# Altium schematic sheet Mainboard-mbed.SchDoc
size A3; PageSetup: Record=PageOptions|CenterHorizontal=True|CenterVertical=True|PrintScale=1.00|XCorrection=1.00|YCorrection=1.00|PrintKind=1|BorderSize=5000000|LeftOffset=0|BottomOffset=0|Orientation=2|PaperLength=1000|PaperWidth=1000|Scale=100|PaperSource=7|PrintQuality=-3|MediaType=1|DitherType=10|PrintScaleMode=1|PaperKind=A3|PaperIndex=8
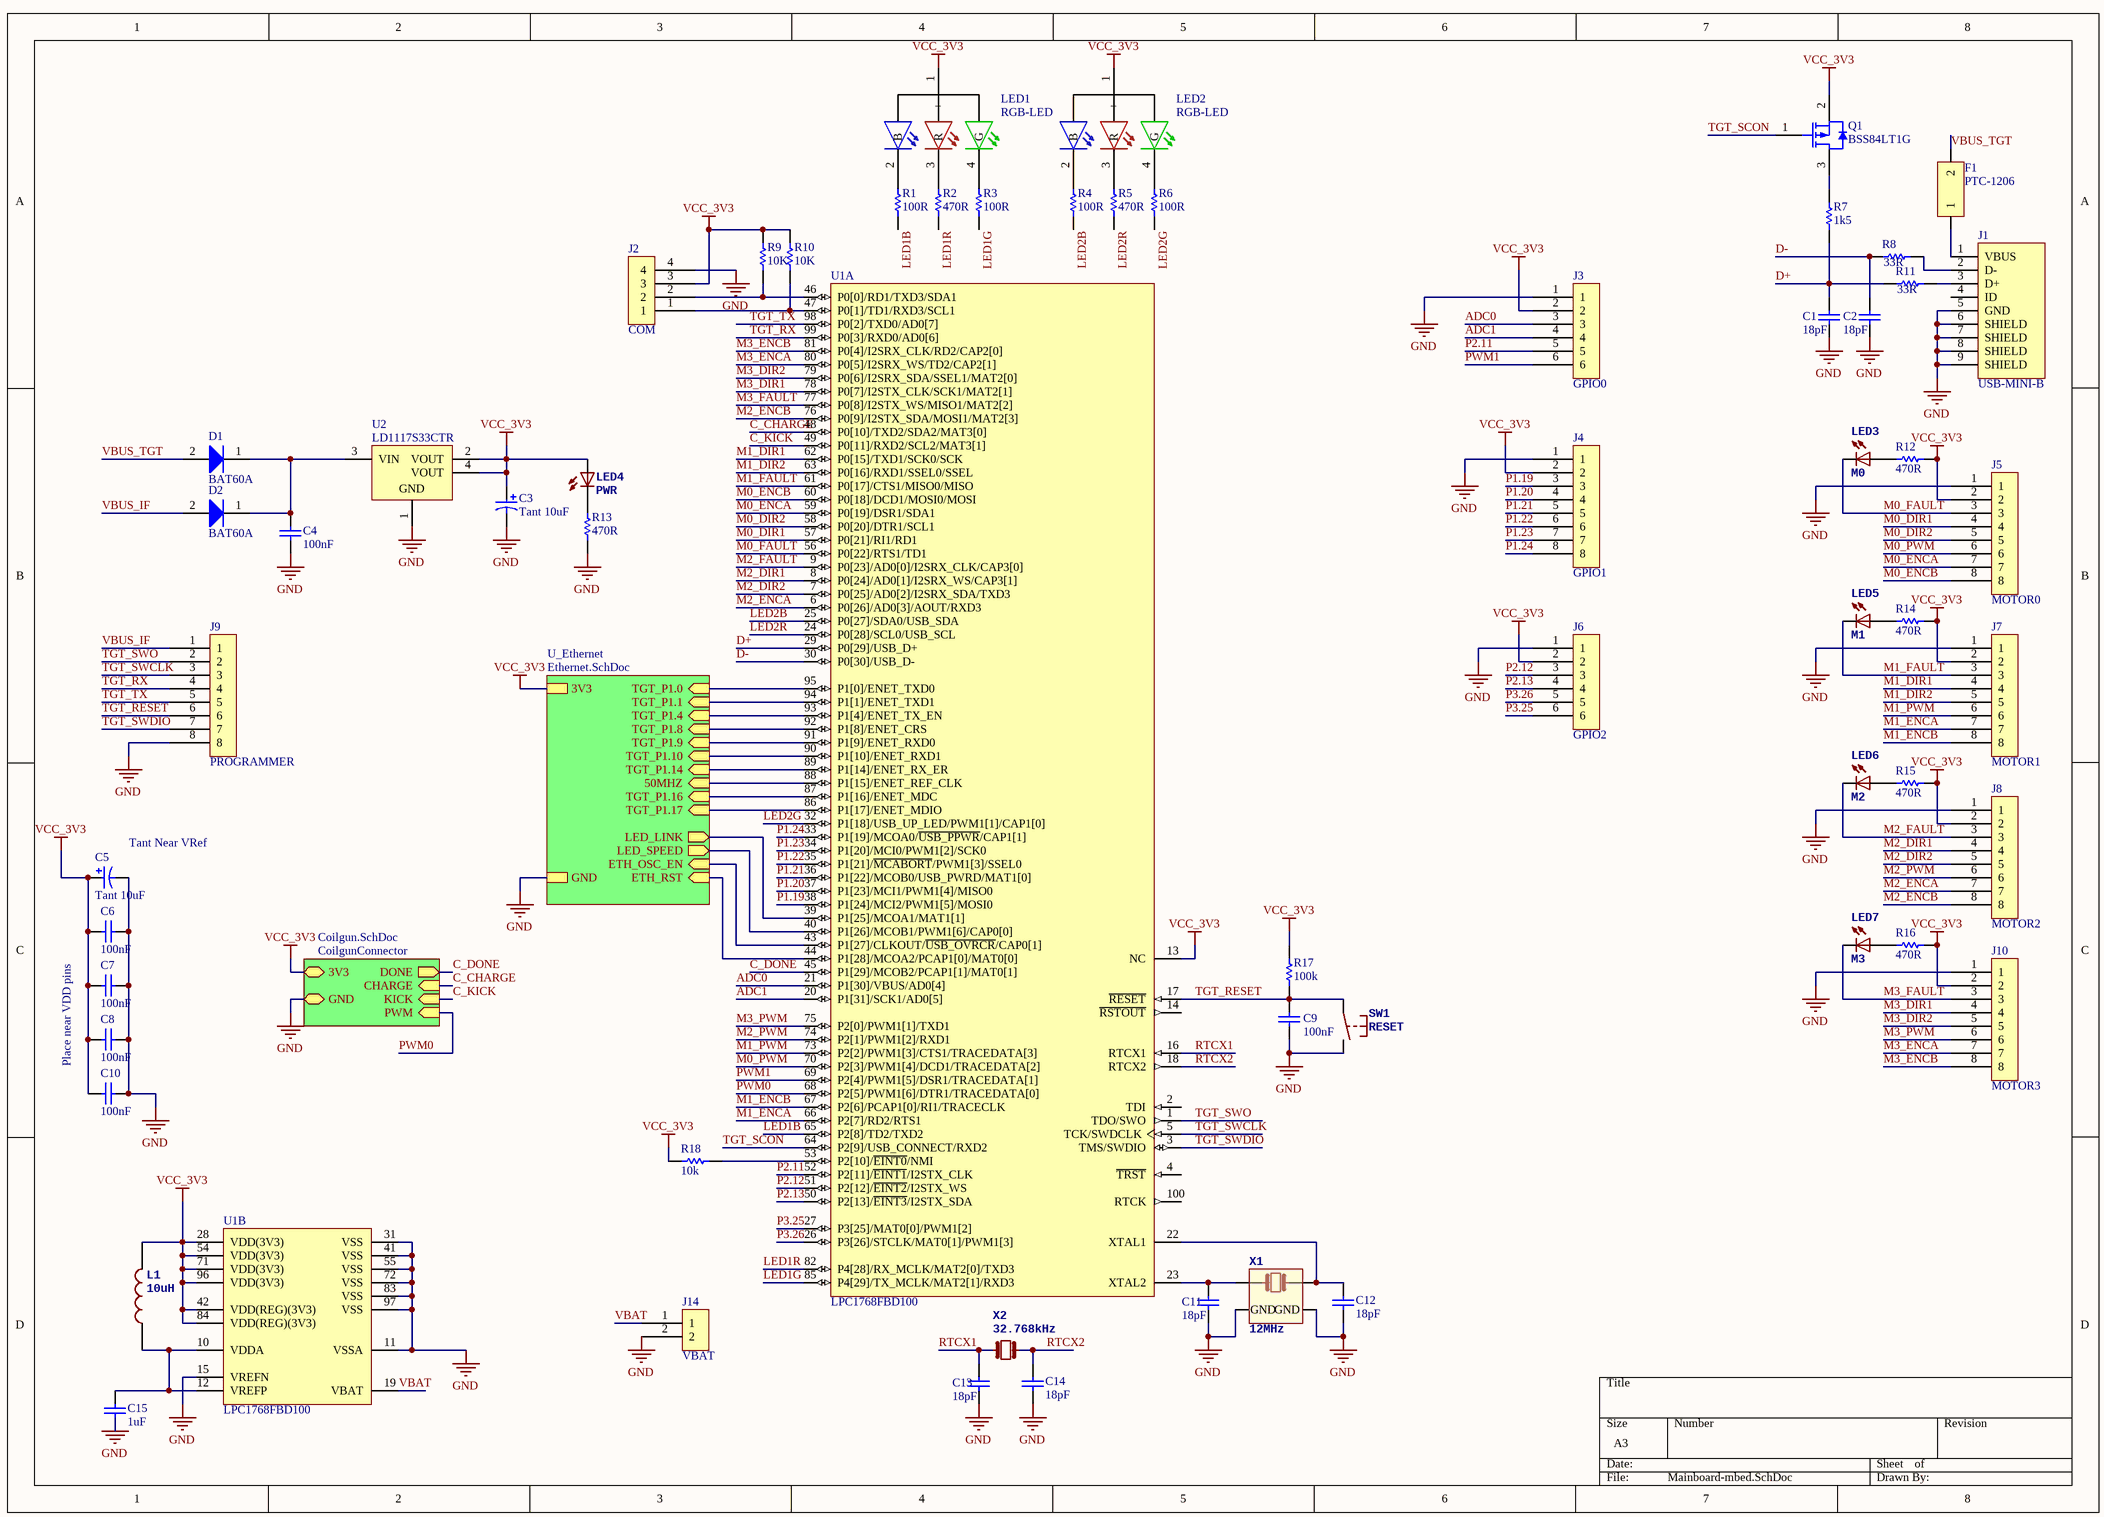
[diagram p0: Mainboard-mbed.SchDoc]

## Parts
C1  value 18pF  [CAPC0603(1608)100_L]  (hidden comment: CAP0603)
C2  value 18pF  [CAPC0603(1608)100_L]  (hidden comment: CAP0603)
C3  Tant 10uF  [CAPMP3528X12N]
C4  value 100nF  [CAPC0603(1608)100_L]  (hidden comment: CAP0603)
C5  Tant 10uF  [CAPMP3528X12N]
C6  100nF  [CAPC0603(1608)100_L]
C7  100nF  [CAPC0603(1608)100_L]
C8  100nF  [CAPC0603(1608)100_L]
C9  value 100nF  [CAPC0603(1608)100_L]  (hidden comment: CAP0603)
C10  100nF  [CAPC0603(1608)100_L]
C11  value 18pF  [CAPC0603(1608)100_L]  (hidden comment: CAP0603)
C12  value 18pF  [CAPC0603(1608)100_L]  (hidden comment: CAP0603)
C13  value 18pF  [CAPC0603(1608)100_L]  (hidden comment: CAP0603)
C14  value 18pF  [CAPC0603(1608)100_L]  (hidden comment: CAP0603)
C15  value 1uF  [CAPC0603(1608)100_L]  (hidden comment: CAP0603)
D1  BAT60A  [INF-SOD323_V]
D2  BAT60A  [INF-SOD323_V]
F1  PTC-1206  [PTC-1206]
J1  USB-MINI-B  [USB-B-MINI]
J2  COM  [MICRO-MATCH-4]
J3  GPIO0  [MICRO-MATCH-6]
J4  GPIO1  [MICRO-MATCH-8]
J5  MOTOR0  [MICRO-MATCH-8]
J6  GPIO2  [MICRO-MATCH-6]
J7  MOTOR1  [MICRO-MATCH-8]
J8  MOTOR2  [MICRO-MATCH-8]
J9  PROGRAMMER  [MICRO-MATCH-8]
J10  MOTOR3  [MICRO-MATCH-8]
J14  VBAT  [PIN-HEADER-2]
L1  10uH  [0603]
LED1  RGB-LED  [RGB-LED]
LED2  RGB-LED  [RGB-LED]
LED3  M0  [CHIPLED_0603]
LED4  PWR  [CHIPLED_0603]
LED5  M1  [CHIPLED_0603]
LED6  M2  [CHIPLED_0603]
LED7  M3  [CHIPLED_0603]
Q1  BSS84LT1G  [ONSC-SOT-23-3-318-08_V]
R1  100R  [RESC0603(1608)_L]
R2  470R  [RESC0603(1608)_L]
R3  100R  [RESC0603(1608)_L]
R4  100R  [RESC0603(1608)_L]
R5  470R  [RESC0603(1608)_L]
R6  100R  [RESC0603(1608)_L]
R7  value 1k5  [RESC0603(1608)_L]  (hidden comment: RES0603)
R8  value 33R  [RESC0603(1608)_L]  (hidden comment: RES0603)
R9  10K  [RESC0603(1608)_L]
R10  10K  [RESC0603(1608)_L]
R11  value 33R  [RESC0603(1608)_L]  (hidden comment: RES0603)
R12  470R  [RESC0603(1608)_N]
R13  470R  [RESC0603(1608)_L]
R14  470R  [RESC0603(1608)_N]
R15  470R  [RESC0603(1608)_N]
R16  470R  [RESC0603(1608)_N]
R17  value 100k  [RESC0603(1608)_L]  (hidden comment: RES0603)
R18  value 10k  [RESC0603(1608)_L]  (hidden comment: RES0603)
SW1  RESET  [DTSM-32S-B]
U1  LPC1768FBD100  [SOT407-1_L]  (parts A,B of 2)
U2  LD1117S33CTR  [SOT-223_N]
X1  12MHz  [3.2X.2.5]
X2  32.768kHz  [FC135]

## Sub-sheets
CoilgunConnector = Coilgun.SchDoc: 3V3, GND, KICK (in), CHARGE (in), DONE (out), PWM (in)
U_Ethernet = Ethernet.SchDoc: ETH_OSC_EN (in), TGT_P1.4 (in), TGT_P1.0 (in), TGT_P1.1 (in), TGT_P1.8 (in), TGT_P1.9 (in), TGT_P1.10 (in), TGT_P1.14 (in), TGT_P1.16 (in), TGT_P1.17 (in), ETH_RST (in), LED_LINK (out), LED_SPEED (out), 50MHZ (in), GND, 3V3

## Nets
GND: C1.2 C2.2 C3.1 C4.1 C5.1 C6.2 C7.2 C8.2 C9.2 C10.2 C11.2 C12.2 C13.2 C14.2 C15.1 J1.5(GND) J1.6(SHIELD) J1.7(SHIELD) J1.8(SHIELD) J1.9(SHIELD) J2.4 J3.1 J4.1 J5.1 J6.1 J7.1 J8.1 J9.8 J10.1 J14.2 R13.2 SW1.P$2(S) U1.11(VSSA) U1.15(VREFN) U1.31(VSS) U1.41(VSS) U1.55(VSS) U1.72(VSS) U1.83(VSS) U1.97(VSS) U2.1(GND) X1.P$2(GND) X1.P$4(GND) ; sheet U_Ethernet/GND, sheet CoilgunConnector/GND
VCC_3V3: C3.2 C5.2 C6.1 C7.1 C8.1 C10.1 J2.3 J3.2 J4.2 J5.2 J6.2 J7.2 J8.2 J10.2 L1.2(P$2) LED1.1(+) LED2.1(+) LED4.A Q1.2(S) R9.2 R10.2 R12.1 R14.1 R15.1 R16.1 R17.2 R18.2 U1.13(NC) U1.28(VDD(3V3)) U1.42(VDD(REG)(3V3)) U1.54(VDD(3V3)) U1.71(VDD(3V3)) U1.84(VDD(REG)(3V3)) U1.96(VDD(3V3)) U2.2(VOUT) U2.4(VOUT) ; sheet U_Ethernet/3V3, sheet CoilgunConnector/3V3
ADC0: J3.3 U1.21(P1[30]/VBUS/AD0[4])
ADC1: J3.4 U1.20(P1[31]/SCK1/AD0[5])
C_CHARGE: U1.48(P0[10]/TXD2/SDA2/MAT3[0]) ; sheet CoilgunConnector/CHARGE
C_DONE: U1.45(P1[29]/MCOB2/PCAP1[1]/MAT0[1]) ; sheet CoilgunConnector/DONE
C_KICK: U1.49(P0[11]/RXD2/SCL2/MAT3[1]) ; sheet CoilgunConnector/KICK
D+: C1.1 R7.1 R11.1 U1.29(P0[29]/USB_D+)
D-: C2.1 R8.1 U1.30(P0[30]/USB_D-)
LED1B: R1.2 U1.65(P2[8]/TD2/TXD2)
LED1G: R3.2 U1.85(P4[29]/TX_MCLK/MAT2[1]/RXD3)
LED1R: R2.1 U1.82(P4[28]/RX_MCLK/MAT2[0]/TXD3)
LED2B: R4.2 U1.25(P0[27]/SDA0/USB_SDA)
LED2G: R6.2 U1.32(P1[18]/USB_UP_LED/PWM1[1]/CAP1[0])
LED2R: R5.1 U1.24(P0[28]/SCL0/USB_SCL)
M0_DIR1: J5.4 U1.57(P0[21]/RI1/RD1)
M0_DIR2: J5.5 U1.58(P0[20]/DTR1/SCL1)
M0_ENCA: J5.7 U1.59(P0[19]/DSR1/SDA1)
M0_ENCB: J5.8 U1.60(P0[18]/DCD1/MOSI0/MOSI)
M0_FAULT: J5.3 LED3.C U1.56(P0[22]/RTS1/TD1)
M0_PWM: J5.6 U1.70(P2[3]/PWM1[4]/DCD1/TRACEDATA[2])
M1_DIR1: J7.4 U1.62(P0[15]/TXD1/SCK0/SCK)
M1_DIR2: J7.5 U1.63(P0[16]/RXD1/SSEL0/SSEL)
M1_ENCA: J7.7 U1.66(P2[7]/RD2/RTS1)
M1_ENCB: J7.8 U1.67(P2[6]/PCAP1[0]/RI1/TRACECLK)
M1_FAULT: J7.3 LED5.C U1.61(P0[17]/CTS1/MISO0/MISO)
M1_PWM: J7.6 U1.73(P2[2]/PWM1[3]/CTS1/TRACEDATA[3])
M2_DIR1: J8.4 U1.8(P0[24]/AD0[1]/I2SRX_WS/CAP3[1])
M2_DIR2: J8.5 U1.7(P0[25]/AD0[2]/I2SRX_SDA/TXD3)
M2_ENCA: J8.7 U1.6(P0[26]/AD0[3]/AOUT/RXD3)
M2_ENCB: J8.8 U1.76(P0[9]/I2STX_SDA/MOSI1/MAT2[3])
M2_FAULT: J8.3 LED6.C U1.9(P0[23]/AD0[0]/I2SRX_CLK/CAP3[0])
M2_PWM: J8.6 U1.74(P2[1]/PWM1[2]/RXD1)
M3_DIR1: J10.4 U1.78(P0[7]/I2STX_CLK/SCK1/MAT2[1])
M3_DIR2: J10.5 U1.79(P0[6]/I2SRX_SDA/SSEL1/MAT2[0])
M3_ENCA: J10.7 U1.80(P0[5]/I2SRX_WS/TD2/CAP2[1])
M3_ENCB: J10.8 U1.81(P0[4]/I2SRX_CLK/RD2/CAP2[0])
M3_FAULT: J10.3 LED7.C U1.77(P0[8]/I2STX_WS/MISO1/MAT2[2])
M3_PWM: J10.6 U1.75(P2[0]/PWM1[1]/TXD1)
P1.19: J4.3 U1.38(P1[24]/MCI2/PWM1[5]/MOSI0)
P1.20: J4.4 U1.37(P1[23]/MCI1/PWM1[4]/MISO0)
P1.21: J4.5 U1.36(P1[22]/MCOB0/USB_PWRD/MAT1[0])
P1.22: J4.6 U1.35(P1[21]/~{MCABORT}/PWM1[3]/SSEL0)
P1.23: J4.7 U1.34(P1[20]/MCI0/PWM1[2]/SCK0)
P1.24: J4.8 U1.33(P1[19]/MCOA0/~{USB_PPWR}/CAP1[1])
P2.11: J3.5 U1.52(P2[11]/~{EINT1}/I2STX_CLK)
P2.12: J6.3 U1.51(P2[12]/~{EINT2}/I2STX_WS)
P2.13: J6.4 U1.50(P2[13]/~{EINT3}/I2STX_SDA)
P3.25: J6.6 U1.27(P3[25]/MAT0[0]/PWM1[2])
P3.26: J6.5 U1.26(P3[26]/STCLK/MAT0[1]/PWM1[3])
PWM0: U1.68(P2[5]/PWM1[6]/DTR1/TRACEDATA[0]) ; sheet CoilgunConnector/PWM
PWM1: J3.6 U1.69(P2[4]/PWM1[5]/DSR1/TRACEDATA[1])
RTCX1: C13.1 U1.16(RTCX1) X2.X2
RTCX2: C14.1 U1.18(RTCX2) X2.X1
TGT_RESET: C9.1 J9.6 R17.1 SW1.P$1(P) U1.17(~{RESET})
TGT_RX: J9.4 U1.99(P0[3]/RXD0/AD0[6])
TGT_SCON: Q1.1(G) U1.64(P2[9]/USB_CONNECT/RXD2)
TGT_SWCLK: J9.3 U1.5(TCK/SWDCLK)
TGT_SWDIO: J9.7 U1.3(TMS/SWDIO)
TGT_SWO: J9.2 U1.1(TDO/SWO)
TGT_TX: J9.5 U1.98(P0[2]/TXD0/AD0[7])
VBAT: J14.1 U1.19(VBAT)
VBUS_IF: D2.2(A) J9.1
VBUS_TGT: D1.2(A) F1.2
NetC4_2: C4.2 D1.1(K) D2.1(K) U2.3(VIN)
NetC11_1: C11.1 U1.23(XTAL2) X1.P$1
NetC12_1: C12.1 U1.22(XTAL1) X1.P$3
NetC15_2: C15.2 L1.1(P$1) U1.10(VDDA) U1.12(VREFP)
NetF1_1: F1.1 J1.1(VBUS)
NetJ1_2: J1.2(D-) R8.2
NetJ1_3: J1.3(D+) R11.2
NetJ2_1: J2.1 R10.1 U1.47(P0[1]/TD1/RXD3/SCL1)
NetJ2_2: J2.2 R9.1 U1.46(P0[0]/RD1/TXD3/SDA1)
NetLED1_2: LED1.2(B) R1.1
NetLED1_3: LED1.3(R) R2.2
NetLED1_4: LED1.4(G) R3.1
NetLED2_2: LED2.2(B) R4.1
NetLED2_3: LED2.3(R) R5.2
NetLED2_4: LED2.4(G) R6.1
NetLED3_A: LED3.A R12.2
NetLED4_C: LED4.C R13.1
NetLED5_A: LED5.A R14.2
NetLED6_A: LED6.A R15.2
NetLED7_A: LED7.A R16.2
NetQ1_3: Q1.3(D) R7.2
NetR18_1: R18.1 U1.53(P2[10]/~{EINT0}/NMI)
NetU1_39: U1.39(P1[25]/MCOA1/MAT1[1]) ; sheet U_Ethernet/LED_LINK
NetU1_40: U1.40(P1[26]/MCOB1/PWM1[6]/CAP0[0]) ; sheet U_Ethernet/LED_SPEED
NetU1_43: U1.43(P1[27]/CLKOUT/~{USB_OVRCR}/CAP0[1]) ; sheet U_Ethernet/ETH_OSC_EN
NetU1_44: U1.44(P1[28]/MCOA2/PCAP1[0]/MAT0[0]) ; sheet U_Ethernet/ETH_RST
NetU1_86: U1.86(P1[17]/ENET_MDIO) ; sheet U_Ethernet/TGT_P1.17
NetU1_87: U1.87(P1[16]/ENET_MDC) ; sheet U_Ethernet/TGT_P1.16
NetU1_88: U1.88(P1[15]/ENET_REF_CLK) ; sheet U_Ethernet/50MHZ
NetU1_89: U1.89(P1[14]/ENET_RX_ER) ; sheet U_Ethernet/TGT_P1.14
NetU1_90: U1.90(P1[10]/ENET_RXD1) ; sheet U_Ethernet/TGT_P1.10
NetU1_91: U1.91(P1[9]/ENET_RXD0) ; sheet U_Ethernet/TGT_P1.9
NetU1_92: U1.92(P1[8]/ENET_CRS) ; sheet U_Ethernet/TGT_P1.8
NetU1_93: U1.93(P1[4]/ENET_TX_EN) ; sheet U_Ethernet/TGT_P1.4
NetU1_94: U1.94(P1[1]/ENET_TXD1) ; sheet U_Ethernet/TGT_P1.1
NetU1_95: U1.95(P1[0]/ENET_TXD0) ; sheet U_Ethernet/TGT_P1.0

Not connected (* = marked no-connect by the designer): J1 4(ID); U1 2(TDI) 4(~{TRST}) 14(~{RSTOUT}) 100(RTCK)

## Notes on the sheet
- (near C5) Tant Near VRef
- Place near VDD pins

## Library data of the parts
C1 C2 C4 C9 C11-C15 = CMP-1590-00005-1: 0603 (1608 Metric) Chip Capacitor; Case-Metric: 1608; Case-EIA: 0603; PackageReference: CAPC0603(1608)100
C3 C5 = cap_pol
C6-C8 C10 = CMP-1035-02579-1: CAP 100nF 10V ±5% 0603 (1608 Metric) Thickness 1mm SMD; Tolerance: Â±5%; Case-EIA: 0603; Case-Metric: 1608; Value: 100nF; Max Thickness: 1 mm; Rated Voltage: 10 V; Technology: SMT
D1 D2 = CMP-1183-00008-2: Silicon Schottky Diode, -55 to 85 degC, SOD323, Reel, Green; Manufacturer: Infineon; Green: TRUE; VR (max): 10Â V; IF (max): 3,000Â mA; VF (max): 370Â mV; CT (max): 35Â pF; Configuration: Single; PackageDescription: 3-Pin Small Outline Transistor Package, 1.25 x 2 mm Body, 0.65 mm Pitch; PartNumber: BAT60A; Mounting Technology: Surface Mount; PackageReference: SOT323; ComponentLink1Description: Manufacturer URL; Packing: Reel; ComponentLink3URL: http://www.infineon.com/dgdl/SOT323-Package_Overview.pdf?folderId=db3a30431936bc4b0119533e1dcb3c92&fileId=db3a30431936bc4b011953495f283cb1; ComponentLink2URL: http://www.infineon.com/dgdl/bat60aseries.pdf?folderId=db3a304313d846880113def5812204a1&fileId=db3a304313d846880113def70c9304a9; ComponentLink1URL: http://www.infineon.com/; ComponentLink2Description: Datasheet; ComponentLink3Description: Package Specification
J1 = USB-B-MINI
J2 = HEADER-4
J3 J6 = HEADER-6
J4 J5 J7-J10 = HEADER-8
J14 = HEADER-2
L1 = L
LED3-LED7 = LED0603
Q1 = CMP-1058-00762-1: Power MOSFET Single P-Channel, -50 V, 10 Ohm, 3-Pin SOT-23, Pb-Free, Tape and Reel; Manufacturer: On Semiconductor; Ciss Typ (pF): 36; ID Max (A): 0.13; Channel Polarity: P Channel; VGS(th) Max (V): 2; VGS Max (V): 20; V(BR)DSS Min (V): 50; Crss Typ (pF): 6.5; PD Max (W): 0.225; Coss Typ (pF): 17; Configuration: Single; Mounting Technology: Surface Mount; ComponentLink3URL: http://www.onsemi.cn/pub_link/Collateral/318-08.PDF; ComponentLink1Description: Manufacturer URL; Package Type: SOT-23-3; ComponentLink2URL: http://www.onsemi.com/pub_link/Collateral/BSS84LT1-D.PDF; RoHS: Pb-Free; Packing: Tape and Reel; ComponentLink1URL: http://www.onsemi.com/; PackageVersion: Rev. AP, 11/2009; PackageReference: SOT-23-3-318-08; PackageDescription: 3-Pin Small Outline Transistor, Body 2.92 x 1.3 mm, Pitch 0.95 mm; DatasheetVersion: Rev. 8; ComponentLink3Description: Package Specification; PartNumber: BSS84LT1G; ComponentLink2Description: Datasheet
R1 R3 R4 R6 = CMP-1012-00050-1: Tolerance: 5 %; Case-EIA: 0603; Value: 100.00 Ohm; Power: 0.1 W; Case-Metric: 1608; Technology: SMT
R2 R5 R12-R16 = CMP-1012-00066-1: 470R 0.1W 5% 0603 (1608 Metric)  SMD; Case-Metric: 1608; Case-EIA: 0603; Value: 470.00 Ohm; Tolerance: 5 %; Technology: SMT; Power: 0.1 W
R7 R8 R11 R17 R18 = CMP-1591-00001-1: 0603 (1608 Metric) Chip Resistor; Case-Metric: 1608; Case-EIA: 0603; PackageReference: RESC0603(1608)
R9 R10 = CMP-1012-00098-1: Case-EIA: 0603; Tolerance: 5 %; Power: 0.1 W; Value: 10000.00 Ohm; Case-Metric: 1608; Technology: SMT
SW1 = SPST
U1 = CMP-0174-00010-4: Cortex-M3, 32-Bit ARM MCU, 512 kB flash, 64 kB SRAM, Ethernet, USB 2.0 Device/Host/OTG, 12-Bit ADC, DAC, I2S, 100-Pin LQFP; USB: 1; CAN: 2; PLL: Y; ADC channels: 8; fmax: 100 MHz; Timers: 4; PWM: 6; VDD (min): 2.4 V; SRAM: 64 kB; Code_IEC: 136E20; Flash: 512 kB; VDD (typ): 3.3 V; GPIOs: 70; VDD (max): 3.6 V; Code_JEDEC: MS-026; DatasheetVersion: Rev. 8, Nov-2011; ComponentLink2Description: Datasheet; ComponentLink1Description: Manufacturer URL; PartNumber: LPC1768FBD100; PackageVersion: 37672; UART: 4; PackageDescription: LQFP100: Plastic Low Profile Quad Flat Package; 100 Leads; Body 14 x 14 x 1.4 mm; SPI: 1; SSP: 2; ComponentLink2URL: http://www.nxp.com/documents/data_sheet/LPC1769_68_67_66_65_64_63.pdf; ComponentLink1URL: http://www.nxp.com/; PackageReference: SOT407-1
U2 = CMP-0244-00307-1: Fixed Low Drop Positive Voltage Regulator, 3.3V, 4-Pin SOT-223, Tape and Reel; ComponentLink1URL: http://www.st.com; PackageVersion: 2010; ComponentLink1Description: Manufacturer URL; DatasheetVersion: 1/11/2011; ComponentLink2URL: http://www.st.com/internet/com/TECHNICAL_RESOURCES/TECHNICAL_LITERATURE/DATASHEET/CD00000544.pdf; PackageReference: SOT-223; ComponentLink2Description: Datasheet; PackageDescription: 4-Pin SOT-223 Package, 6.5 x 3.5 mm Body, 2.3 mm Pitch, 7 mm Lead Span
X1 = Q_3.2X2.5
X2 = Q_FC135